# Altium schematic sheet Myespsch1.SchDoc
size A3
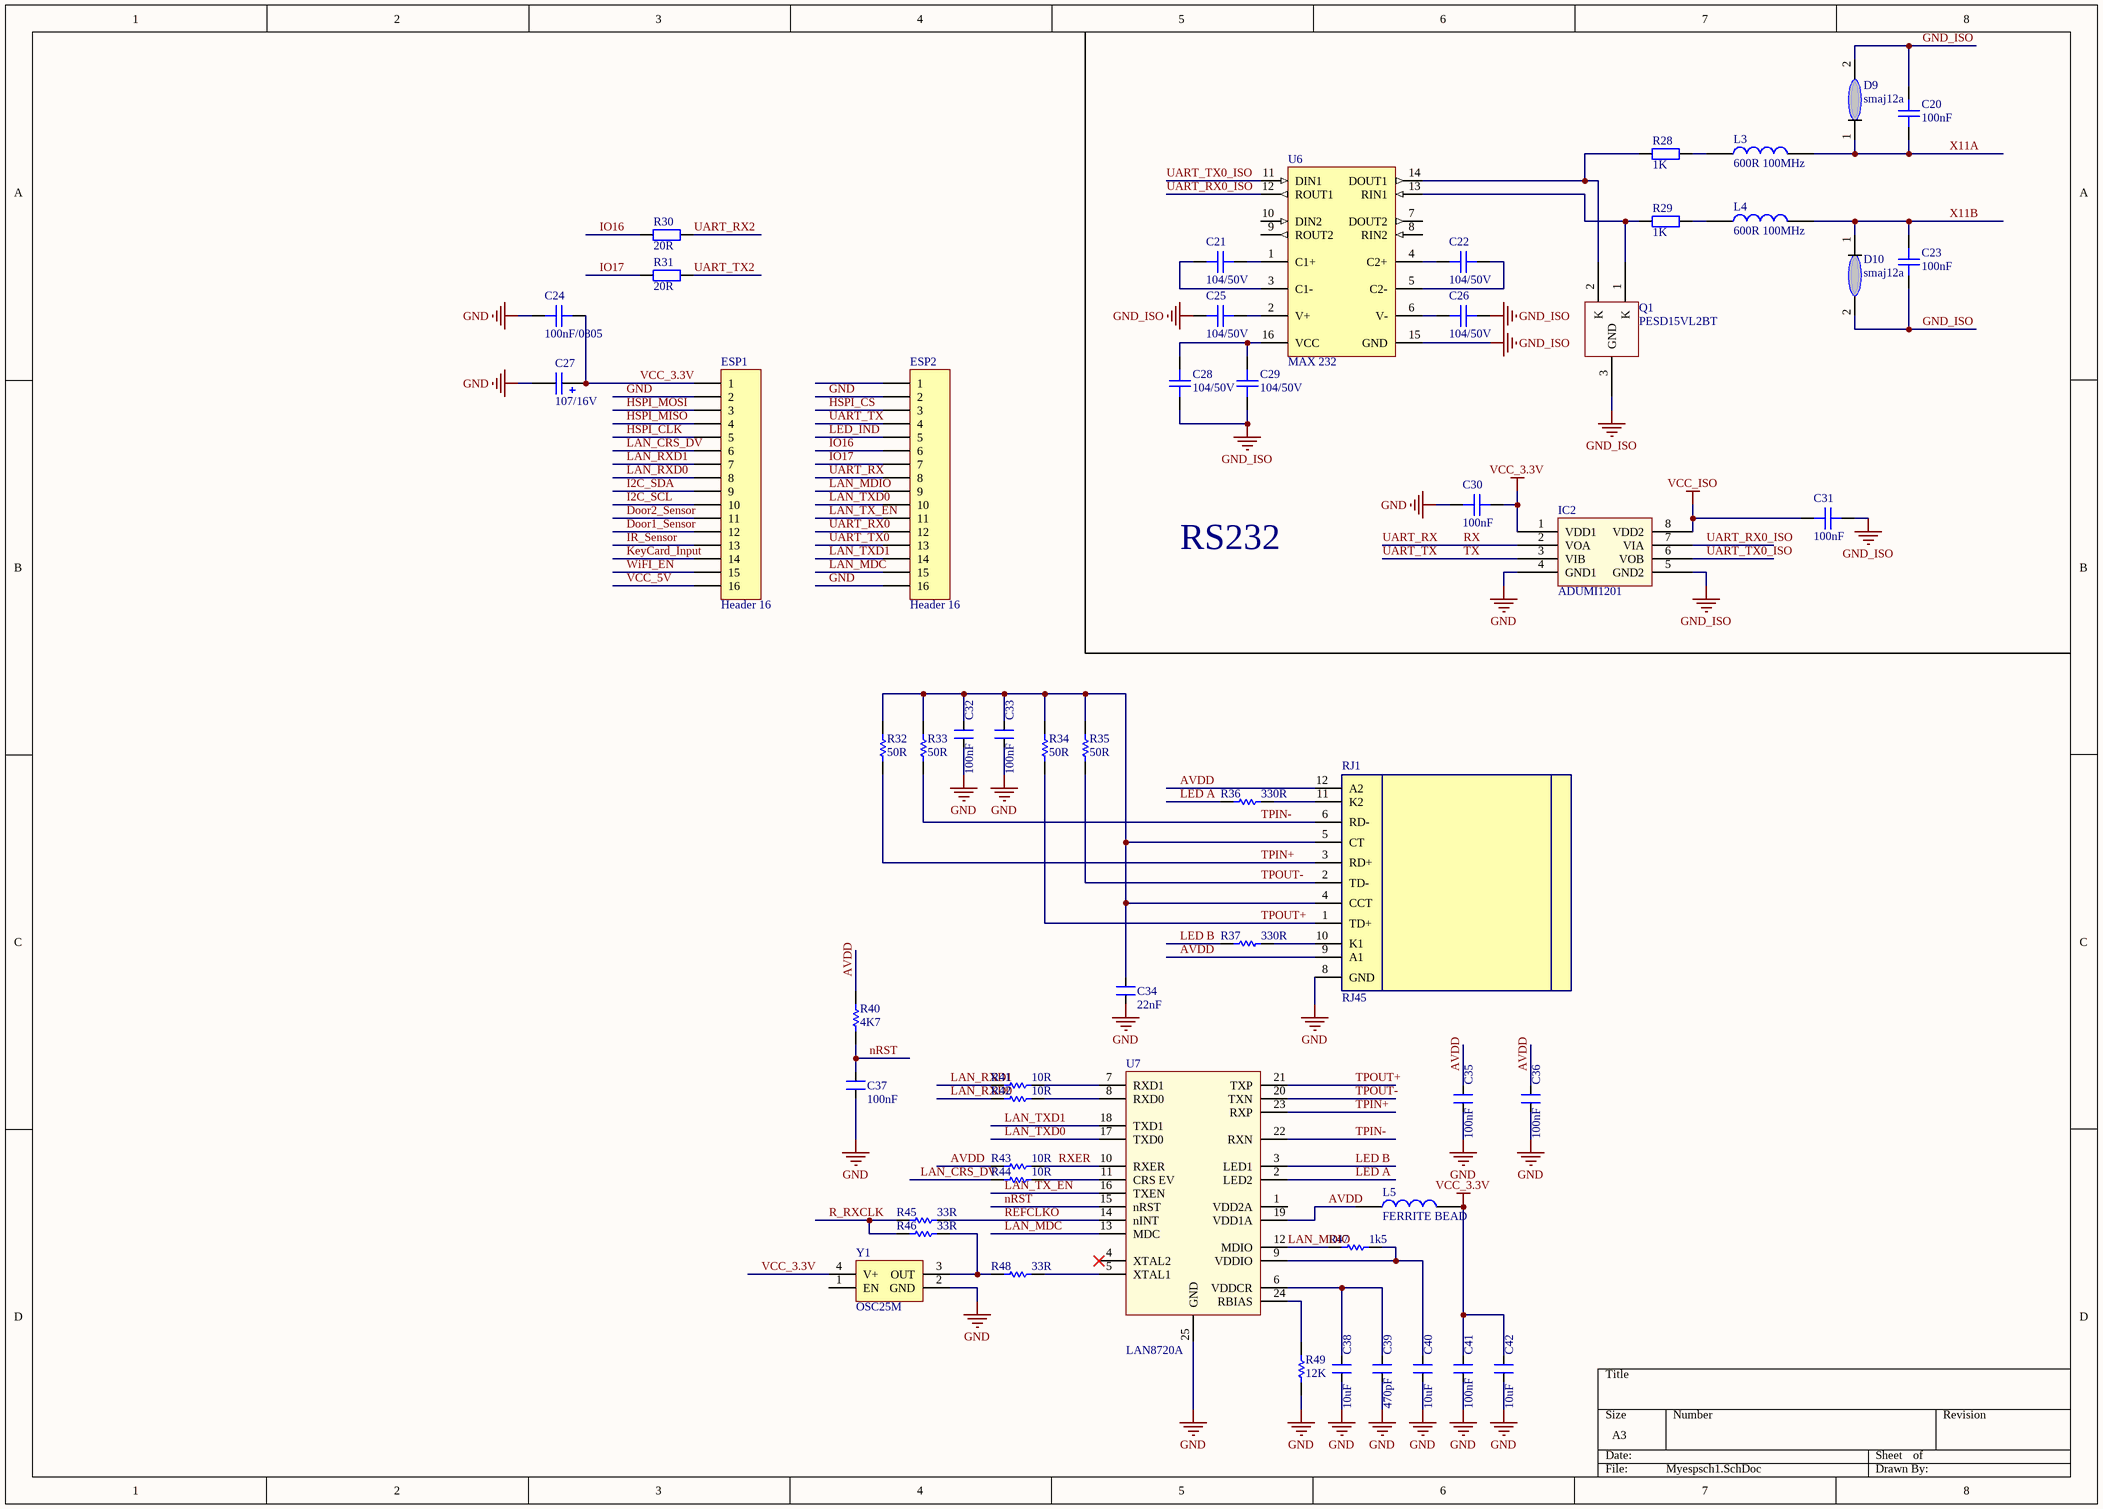
[diagram p0: Myespsch1.SchDoc]

## Parts
C20  100nF  [CAPC-0603 (1608)]
C21  104/50V  [CAPC-0603 (1608)]
C22  104/50V  [CAPC-0603 (1608)]
C23  100nF  [CAPC-0603 (1608)]
C24  100nF/0805  [CAPC-0805 (2012)]
C25  104/50V  [CAPC-0603 (1608)]
C26  104/50V  [CAPC-0603 (1608)]
C27  107/16V  [CAP_TANTAL_2917(7343-31)]
C28  104/50V  [CAPC-0603 (1608)]
C29  104/50V  [CAPC-0603 (1608)]
C30  100nF  [CAPC-0603 (1608)]
C31  100nF  [CAPC-0603 (1608)]
C32  100nF  [CAPC-0805 (2012)]
C33  100nF  [CAPC-0805 (2012)]
C34  22nF  [CAPC-0805 (2012)]
C35  100nF  [CAPC-0805 (2012)]
C36  100nF  [CAPC-0805 (2012)]
C37  100nF  [RESC-0805 (2012)]
C38  10uF  [CAPC-0805 (2012)]
C39  470pF  [CAPC-0805 (2012)]
C40  10uF  [CAPC-0805 (2012)]
C41  100nF  [CAPC-0805 (2012)]
C42  10uF  [CAPC-0805 (2012)]
D9  smaj12a  [DIODE_DO214AC_SMA]
D10  smaj12a  [DIODE_DO214AC_SMA]
ESP1  Header 16  [HDR1X16]
ESP2  Header 16  [HDR1X16]
IC2  ADUMI1201  [SOIC-8]
L3  600R 100MHz  [IND-0603 (1608)]
L4  600R 100MHz  [IND-0603 (1608)]
L5  FERRITE BEAD  [IND-0805 (2012)]
Q1  PESD15VL2BT  [SOT23]
R28  1K  [RESC-0603 (1608)]
R29  1K  [RESC-0603 (1608)]
R30  20R  [RESC-0603 (1608)]
R31  20R  [RESC-0603 (1608)]
R32  50R  [RESC-0805 (2012)]
R33  50R  [RESC-0805 (2012)]
R34  50R  [RESC-0805 (2012)]
R35  50R  [RESC-0805 (2012)]
R36  330R  [RESC-0805 (2012)]
R37  330R  [RESC-0805 (2012)]
R40  4K7  [RESC-0805 (2012)]
R41  10R  [RESC-0805 (2012)]
R42  10R  [RESC-0805 (2012)]
R43  10R  [RESC-0805 (2012)]
R44  10R  [RESC-0805 (2012)]
R45  33R  [RESC-0805 (2012)]
R46  33R  [RESC-0805 (2012)]
R47  1k5  [RESC-0805 (2012)]
R48  33R  [RESC-0805 (2012)]
R49  12K  [RESC-0805 (2012)]
RJ1  RJ45  [CON JR45]
U6  MAX 232  [SOIC-16]
U7  LAN8720A  [24-VFQFN]
Y1  OSC25M  [CRYSTALL_SMD_3225]

## Nets
GND: C24.1 C27.2 C30.2 C32.2 C33.2 C34.2 C35.2 C36.2 C37.2 C38.2 C39.2 C40.2 C41.2 C42.2 ESP1.2 ESP2.2 ESP2.16 IC2.4(GND1) R49.1 RJ1.8(GND) U7.25(GND) Y1.2(GND)
GND_ISO: C20.1 C23.2 C25.1 C26.2 C28.1 C29.1 C31.1 D9.2 D10.2 IC2.5(GND2) Q1.3(GND) U6.15(GND)
VCC_3.3V: C24.2 C27.1 C30.1 C41.1 C42.1 ESP1.1 IC2.1(VDD1) L5.2 Y1.4(V+)
VCC_ISO: C31.2 IC2.8(VDD2)
AVDD: C35.1 C36.1 L5.1 R40.1 R43.2 RJ1.9(A1) RJ1.12(A2) U7.19(VDD1A)
Door1_Sensor: ESP1.12
Door2_Sensor: ESP1.11
HSPI_CLK: ESP1.5
HSPI_CS: ESP2.3
HSPI_MISO: ESP1.4
HSPI_MOSI: ESP1.3
I2C_SCL: ESP1.10
I2C_SDA: ESP1.9
IO16: ESP2.6 R30.1
IO17: ESP2.7 R31.1
IR_Sensor: ESP1.13
KeyCard_Input: ESP1.14
LAN_CRS_DV: ESP1.6 R44.2
LAN_MDC: ESP2.15 U7.13(MDC)
LAN_MDIO: ESP2.9 R47.2 U7.12(MDIO)
LAN_RXD0: ESP1.8 R42.2
LAN_RXD1: ESP1.7 R41.2
LAN_TX_EN: ESP2.11 U7.16(TXEN)
LAN_TXD0: ESP2.10 U7.17(TXD0)
LAN_TXD1: ESP2.14 U7.18(TXD1)
LED A: R36.1 U7.2(LED2)
LED B: R37.1 U7.3(LED1)
LED_IND: ESP2.5
nRST: C37.1 R40.2 U7.15(nRST)
R_RXCLK: R45.2 R46.2
REFCLKO: R45.1 U7.14(nINT)
RX: ESP2.8 IC2.2(VOA)  [also labelled UART_RX]
RXER: R43.1 U7.10(RXER)
TPIN+: R32.1 RJ1.3(RD+) U7.23(RXP)
TPIN-: R33.1 RJ1.6(RD-) U7.22(RXN)
TPOUT+: R34.1 RJ1.1(TD+) U7.21(TXP)
TPOUT-: R35.1 RJ1.2(TD-) U7.20(TXN)
TX: ESP2.4 IC2.3(VIB)  [also labelled UART_TX]
UART_RX0: ESP2.12
UART_RX0_ISO: IC2.7(VIA) U6.12(ROUT1)
UART_RX2: R30.2
UART_TX0: ESP2.13
UART_TX0_ISO: IC2.6(VOB) U6.11(DIN1)
UART_TX2: R31.2
VCC_5V: ESP1.16
WiFI_EN: ESP1.15
X11A: C20.2 D9.1 L3.2
X11B: C23.1 D10.1 L4.2
NetC21_1: C21.1 U6.3(C1-)
NetC21_2: C21.2 U6.1(C1+)
NetC22_1: C22.1 U6.4(C2+)
NetC22_2: C22.2 U6.5(C2-)
NetC25_2: C25.2 U6.2(V+)
NetC26_1: C26.1 U6.6(V-)
NetC28_2: C28.2 C29.2 U6.16(VCC)
NetC32_1: C32.1 C33.1 C34.1 R32.2 R33.2 R34.2 R35.2 RJ1.4(CCT) RJ1.5(CT)
NetC38_1: C38.1 C39.1 U7.6(VDDCR)
NetC40_1: C40.1 R47.1 U7.9(VDDIO)
NetL3_1: L3.1 R28.2
NetL4_1: L4.1 R29.2
NetQ1_1: Q1.1(K) R29.1 U6.13(RIN1)
NetQ1_2: Q1.2(K) R28.1 U6.14(DOUT1)
NetR36_2: R36.2 RJ1.11(K2)
NetR37_2: R37.2 RJ1.10(K1)
NetR41_1: R41.1 U7.7(RXD1)
NetR42_1: R42.1 U7.8(RXD0)
NetR44_1: R44.1 U7.11(CRS_EV)
NetR46_1: R46.1 R48.2 Y1.3(OUT)
NetR48_1: R48.1 U7.5(XTAL1)
NetR49_2: R49.2 U7.24(RBIAS)

Not connected (* = marked no-connect by the designer): ESP2 1; U6 7(DOUT2) 8(RIN2) 9(ROUT2) 10(DIN2); U7 1(VDD2A) 4(XTAL2)*; Y1 1(EN)

## Notes on the sheet
- RS232

## Library data of the parts
C20 C23 C30 C31 = C0603C104K5RACTU: CompanyID: VT-00982; Solder: SMT; Value: 104/50V; MPN: C0603C104K5RACTU; Category: CAPACITOR; PinCount: 2
C21 C22 C25 C26 C28 C29 = C0603C104K5RACTU: CAP CER 0.1uF 50V 10% X7R 0603; CompanyID: VT-00982; Solder: SMT; MPN: C0603C104K5RACTU; Value: 104/50V; Category: CAPACITOR; PinCount: 2
C24 = 0805C225K8PAC7800: CAP CER 2.2uF 10% 10V X5R 0805; CompanyID: VT-00292; Solder: SMT; Value: 225/10V; MPN: 0805C225K8PAC7800; Category: CAPACITOR; PinCount: 2
C27 = TAJD107K016RNJ: CAP TANT 100uF 16V 10% 2917; Solder: SMT; CompanyID: VT-00022; MPN: TAJD107K016RNJ; Value: 107/16V; Category: CAPACITOR; PinCount: 2
C32-C42 = CAP CERA 0805: CERAMIC CAP 0805; Value: 100pF, 2012
ESP1 ESP2 = Header 16: Header, 16-Pin; LatestRevisionDate: 17-Jul-2002; LatestRevisionNote: Re-released for DXP Platform.; Publisher: Altium Limited
L3 L4 = LQM18PN2R2MFHD: FIXED IND 2.2UH 700MA 375 MOHM; MFR: Murata Electronics; Solder: SMT; Value: 2.2uH/700mA; MPN: LQM18PN2R2MFHD; Category: INDUCTOR
L5 = 742792042: IND-FERRITE BEAD 600 OHM 1LN 0805; CompanyID: VT-01115; Solder: SMT; Value: 600OHM/200mA; MPN: 742792042; Category: FERRITE BEAD; PinCount: 2
R28 R29 = RC0603FR-074K7L: RES SMD 4.7K OHM 1% 1/10W 0603; CompanyID: VT-00327; Solder: SMT; Value: 4K7; MPN: RC0603FR-074K7L; Category: RESISTOR
R30 R31 = CRCW060320R0FKEA: RES SMD 20 OHM 1% 1/10W 0603; CompanyID: VT-01023; Solder: SMT; Value: 20R; MPN: CRCW060320R0FKEA; Category: RESISTOR
R32-R37 R40-R49 = RES-0805: RES SMD 249K OHM 1% 1/10W 0805; Manufacturer: Yageo; Manufacturer Part Number: RC0603FR-07249KL; Power (Watts): 0.1W, 1/10W; Temperature Coefficient: ±100ppm/°C; Supplier 1: Digi-Key; RoHS: RoHS Compliant; Category: Resistors; Stock 1: 370515; Pricing 1: 1=0.1, 10=0.015, 100=0.006, 1000=0.00268, 2500=0.00233 (USD); Packaging: Cut Tape (CT); Part Status: Active; Tolerance: ±1%; Composition: Thick Film; Features: Moisture Resistant; Operating Temperature: -55°C ~ 155°C; Package / Case: 0603 (1608 Metric); Supplier Device Package: 0603; Size / Dimension: 0.063" L x 0.032" W (1.60mm x 0.80mm); Height - Seated (Max): 0.022" (0.55mm); Failure Rate: -; ComponentLink1URL: http://www.yageo.com/documents/recent/PYu-RC_Group_51_RoHS_L_8.pdf; ComponentLink1Description: http://www.yageo.com/documents/recent/PYu-RC_Group_51_RoHS_L_8.pdf
RJ1 = RJ45_2
U6 = MAX3232CDRE4, MAX3232CDR: IC DRVR/RCVR MULTCH RS232 16SOIC; Solder: SMT; MPN: MAX3232CDRE4, MAX3232CDR; Value: MAX 232; Category: IC
Y1 = AU-25.000MBE-T: XTAL OSC XO 25.0000MHZ CMOS SMD; Solder: SMT; Value: OSC25M; MPN: AU-25.000MBE-T; Category: CRYSTAL; PinCount: 4